# EAGLE schematic SCHALTPLAN-3V3-Step-down-Converter (EAGLE 9.6.2)
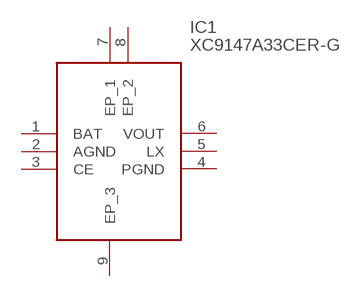
[diagram p0: schematic, sheet 1]

## Parts
IC1  XC9147A33CER-G  [XC9147/8_USP-6C]
Unconnected: IC1.1(BAT) IC1.2(AGND) IC1.3(CE) IC1.4(PGND) IC1.5(LX) IC1.6(VOUT) IC1.7(EP_1) IC1.8(EP_2) IC1.9(EP_3)

## Library data of the parts
IC1 = XC9147A33CER-G:XC9147A33CER-G: Highly functionality, 1.4A Step-up DC/DC Converters, USP-6C Source: Datasheet <https://www.torex.co.jp/file/xc9147/xc9147.pdf>; DESCRIPTION: Highly functionality, 1.4A Step-up DC/DC Converters, USP-6C; HEIGHT: 0.6mm; MANUFACTURER_NAME: Torex; MANUFACTURER_PART_NUMBER: XC9147A33CER-G